# Altium schematic sheet P07_Peripheral.SchDoc
size A4; SheetNumber: 7; SheetTotal: 7
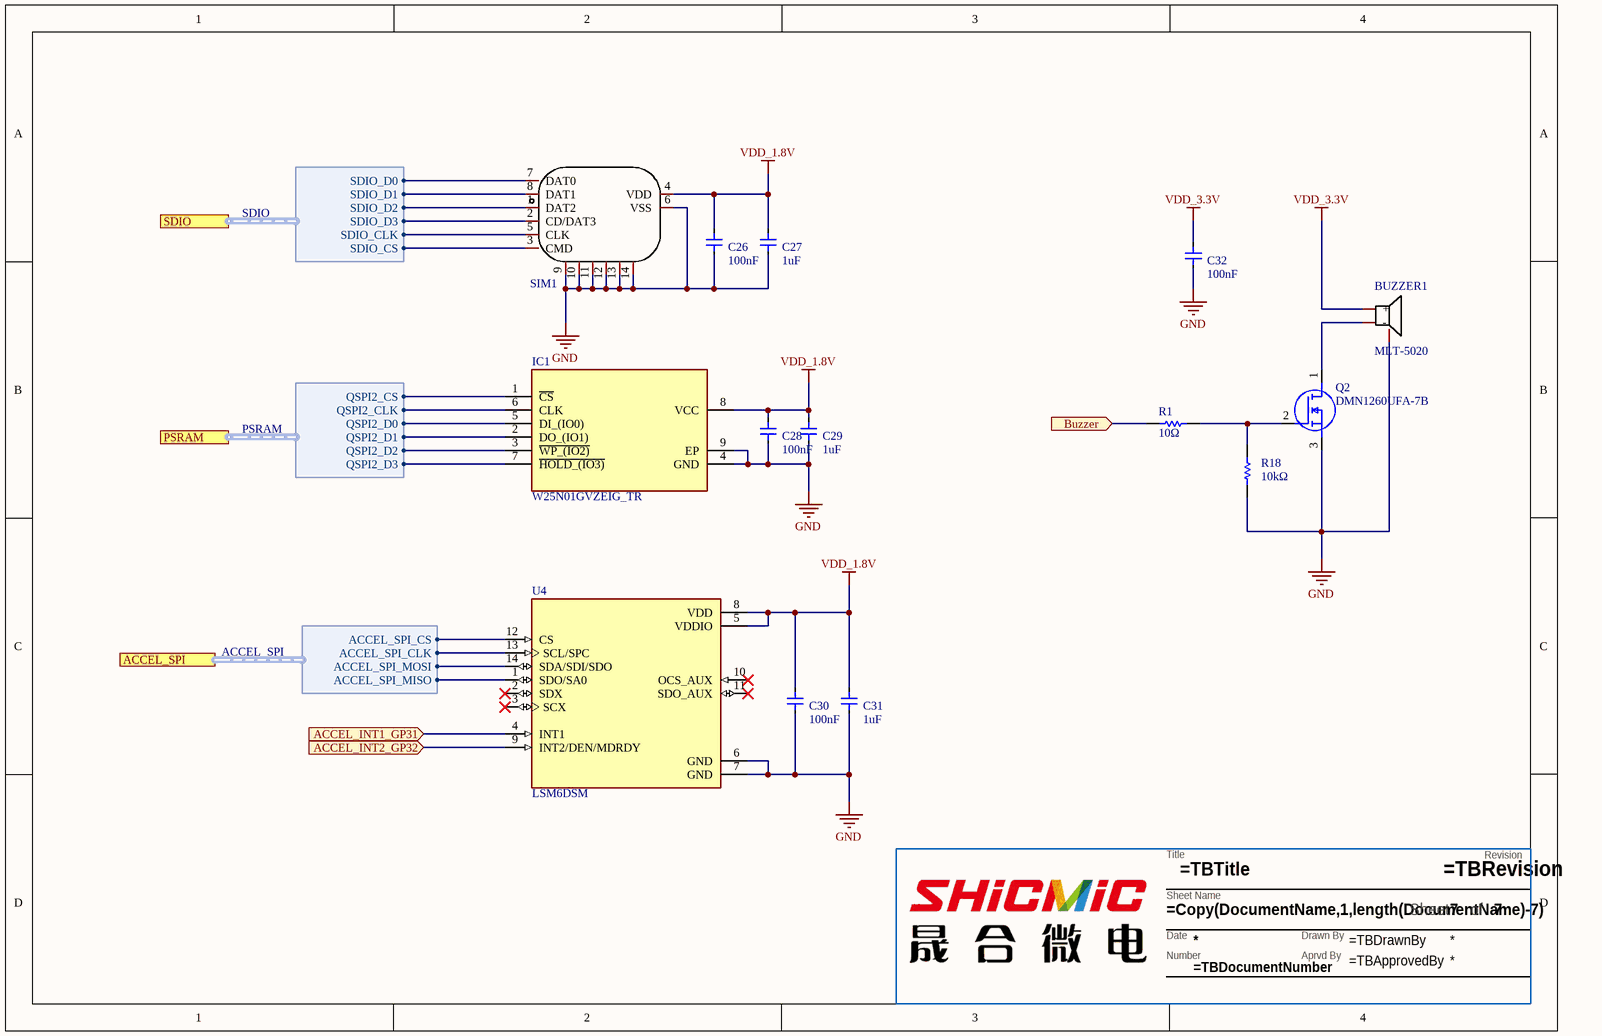
[diagram p0: P07_Peripheral.SchDoc]

## Parts
??  TitleBlock  (value not drawn)  (graphical)
BUZZER1  4000Hz  [BUZ-SMD_L5.0-W5.5-P4.60]  (value not drawn)
C26  100nF  [CAP_0402]
C27  1uF  [CAP_0402]
C28  100nF  [CAP_0402]
C29  1uF  [CAP_0402]
C30  100nF  [CAP_0402]
C31  1uF  [CAP_0402]
C32  100nF  [CAP_0402]
IC1  W25N01GVZEIG_TR  [SON127P800X600X80-9N-D]
Q2  DMN1260UFA-7B  [DMN1260UFA7B]
R1  10Ω  [RES_0402]
R18  10kΩ  [RES_0402]
SIM1  1040310811  [SIM-SMD_8P-1040310811]  (value not drawn)
U4  LSM6DSM  [PQFN50P300X250X86-14N]

## Ports
ACCEL_INT1_GP31 (in), ACCEL_INT2_GP32 (in), ACCEL_SPI (harness ACCEL_SPI), Buzzer (in), PSRAM (harness PSRAM), SDIO (harness SDIO)

## Harnesses
ACCEL_SPI: ACCEL_SPI_CLK, ACCEL_SPI_CS, ACCEL_SPI_MISO, ACCEL_SPI_MOSI
PSRAM: QSPI2_CLK, QSPI2_CS, QSPI2_D0, QSPI2_D1, QSPI2_D2, QSPI2_D3
SDIO: SDIO_CLK, SDIO_CS, SDIO_D0, SDIO_D1, SDIO_D2, SDIO_D3

## Nets
GND: BUZZER1.3(NC) C26.2 C27.2 C28.2 C29.2 C30.2 C31.2 C32.2 IC1.4(GND) IC1.9(EP) Q2.3(S) R18.1 SIM1.6(VSS) SIM1.9 SIM1.10 SIM1.11 SIM1.12 SIM1.13 SIM1.14 U4.6(GND) U4.7(GND)
VDD_1.8V: C26.1 C27.1 C28.1 C29.1 C30.1 C31.1 IC1.8(VCC) SIM1.4(VDD) U4.5(VDDIO) U4.8(VDD)
VDD_3.3V: BUZZER1.1(+) C32.1
ACCEL_INT1_GP31: U4.4(INT1) ; port ACCEL_INT1_GP31
ACCEL_INT2_GP32: U4.9(INT2/DEN/MDRDY) ; port ACCEL_INT2_GP32
Buzzer: R1.2 ; port Buzzer
NetBUZZER1_2: BUZZER1.2(-) Q2.1(D)
NetIC1_1: IC1.1(~{CS}) ; port PSRAM.QSPI2_CS
NetIC1_2: IC1.2(DO_(IO1)) ; port PSRAM.QSPI2_D1
NetIC1_3: IC1.3(~{WP_(IO2)}) ; port PSRAM.QSPI2_D2
NetIC1_5: IC1.5(DI_(IO0)) ; port PSRAM.QSPI2_D0
NetIC1_6: IC1.6(CLK) ; port PSRAM.QSPI2_CLK
NetIC1_7: IC1.7(~{HOLD_(IO3)}) ; port PSRAM.QSPI2_D3
NetQ2_2: Q2.2(G) R1.1 R18.2
NetSIM1_1: SIM1.1(DAT2) ; port SDIO.SDIO_D2
NetSIM1_2: SIM1.2(CD/DAT3) ; port SDIO.SDIO_D3
NetSIM1_3: SIM1.3(CMD) ; port SDIO.SDIO_CS
NetSIM1_5: SIM1.5(CLK) ; port SDIO.SDIO_CLK
NetSIM1_7: SIM1.7(DAT0) ; port SDIO.SDIO_D0
NetSIM1_8: SIM1.8(DAT1) ; port SDIO.SDIO_D1
NetU4_1: U4.1(SDO/SA0) ; port ACCEL_SPI.ACCEL_SPI_MISO
NetU4_12: U4.12(CS) ; port ACCEL_SPI.ACCEL_SPI_CS
NetU4_13: U4.13(SCL/SPC) ; port ACCEL_SPI.ACCEL_SPI_CLK
NetU4_14: U4.14(SDA/SDI/SDO) ; port ACCEL_SPI.ACCEL_SPI_MOSI

Not connected (* = marked no-connect by the designer): U4 2(SDX)* 3(SCX)* 10(OCS_AUX)* 11(SDO_AUX)*

## Notes on the sheet
- (in symbol TitleBlock) Revision; Title; Sheet Name; Sheet; of; Date; Drawn By; Number; Aprvd By

## Library data of the parts
?? = TitleBlock: Title block for Ambiq Schematics. Please have the following parameters entered in Project>Project Options>Parameters: / TBTitle / TBDocumentNumber / TBRevision / TBDrawnBy / TBApprovedBy; AMBIQ PN: TitleBlock
BUZZER1 = MLT-5020: Manufacturer: 华能; Add into BOM: yes; Oscillator Circuit: 无源(外部驱动); Technology Type: 电磁式; Name: 4000Hz; Symbol: MLT-5020; LCSC Part Name: MLT-5020; Supplier Part: C94598; Manufacturer Part: MLT-5020; Supplier Footprint: SMD,5x5mm; JLCPCB Part Class: 扩展库; Datasheet: https://atta.szlcsc.com/upload/public/pdf/source/20210811/111454390007D221D7259018FB170E62.pdf; Supplier: LCSC; Convert to PCB: yes; Value: 4000Hz; Length: 5.2mm; Width: 5.2mm; Height: 2.5mm; Device: MLT-5020
C26 C28 C30 C32 = Capacitor: NONE; Manufacturer: Kyocera AVX; AMBIQ PN: 0201ZD104KAT2A; Tolerance: 10%; Voltage Rating: 10V; Supplier 1: Arrow Electronics; Supplier Part Number 1: 0201ZD104KAT2A; Manufacturer Part Number: 0201ZD104KAT2A; RoHS: Yes; Category: Ceramic Capacitors; Stock 1: 105000; Pricing 1: 15000=0.00770, 30000=0.00750, 45000=0.00740, 60000=0.00720, 75000=0.00690, 150000=0.00620 (USD); Mount: Surface Mount; Case/Package: 0201; Case Code (Metric): 0603; Case Code (Imperial): 0201; Min Operating Temperature: -55°C; Max Operating Temperature: 85°C; Capacitance: 100nF; Packaging: Tape and Reel; Voltage Rating (DC): 10V; Series: -; Lead Free: Lead Free; RoHS Compliant: Yes; ComponentLink1URL: http://www.mouser.com/ds/2/40/cx5r-776519.pdf?src-supplier=Mouser; ComponentLink1Description: http://www.mouser.com/ds/2/40/cx5r-776519.pdf?src-supplier=Mouser
C27 C29 C31 = Capacitor: NONE; Manufacturer: Samsung; Manufacturer Part Number: CL05A105MP5NNNC; AMBIQ PN: CL05A105KP5NNNC; Tolerance: 20%; Voltage Rating: 10V; Dielectric: X5R; Supplier 1: Newark; Supplier Part Number 1: 82AC9184; RoHS: Yes; Category: Ceramic Capacitors; Mount: Surface Mount; Case/Package: 0402; Case Code (Metric): 1005; Case Code (Imperial): 0402; Min Operating Temperature: -55°C; Max Operating Temperature: 85°C; Capacitance: 1uF; Packaging: Tape and Reel; Voltage Rating (DC): 10V; Series: CL; Construction: Flat; Length: 1mm; Width: 0.02inch; Height: 0.5mm; Thickness: 0.022inch; Depth: 0.5mm; Radiation Hardening: No; Lead Free: Lead Free; RoHS Compliant: Yes; ComponentLink1URL: https://datasheet.ciiva.com/25802/cl05a105mp5nnnc-25802049.pdf?src-supplier=Digi-Key; ComponentLink1Description: https://datasheet.ciiva.com/25802/cl05a105mp5nnnc-25802049.pdf?src-supplier=Digi-Key; Package Quantity: 1
IC1 = W25N01GVZEIG_TR: Integrated Circuit; Manufacturer_Name: Winbond; Manufacturer_Part_Number: W25N01GVZEIG TR; Datasheet Link: https://www.winbond.com/resource-files/w25n01gv revg 032116.pdf; Height: 0.8mm; Mouser Part Number: 454-W25N01GVZEIGTR; Mouser Price/Stock: https://www.mouser.co.uk/ProductDetail/Winbond/W25N01GVZEIG-TR?qs=qSfuJ%252Bfl%2Fd6niBi0Qz1MPg%3D%3D; Arrow Part Number: W25N01GVZEIG TR; Arrow Price/Stock: https://www.arrow.com/en/products/w25n01gvzeigtr/winbond-electronics?region=nac
Q2 = DMN1260UFA-7B: MOSFET (N-Channel); Manufacturer_Name: Diodes Incorporated; Datasheet Link: https://www.diodes.com/assets/Datasheets/DMN1260UFA.pdf; Height: 0.4mm; Manufacturer_Part_Number: DMN1260UFA-7B; Mouser Part Number: 621-DMN1260UFA-7B; Mouser Price/Stock: https://www.mouser.co.uk/ProductDetail/Diodes-Incorporated/DMN1260UFA-7B?qs=TL2rE588Q1GjQdkyrZCA4w%3D%3D; Arrow Part Number: DMN1260UFA-7B; Arrow Price/Stock: https://www.arrow.com/en/products/dmn1260ufa-7b/diodes-incorporated
R1 R18 = Resistor: Surface Mount Thick Film Resistor, Rc Series, 10 Kohm, 62.5 Mw, - 1%, 50 V, 0402 [1005 Metric]; Manufacturer: Yageo; AMBIQ PN: RC0402FR-0710KL; Resistance: 10kR; Power Rating: 62.5mW; Voltage Rating: 50V; Max Power Dissipation: 63mW; Temperature Coefficient: 100ppm/°C; Supplier 1: Arrow Electronics; Supplier Part Number 1: RC0402FR-0710KL; Manufacturer Part Number: RC0402FR-0710KL; RoHS: Yes; Category: Chip SMD Resistors; Stock 1: 7776428; Pricing 1: 10000=0.00210 (USD); Case/Package: 0402; Case Code (Metric): 1005; Case Code (Imperial): 0402; Min Operating Temperature: -55°C; Max Operating Temperature: 155°C; Packaging: Tape and Reel; Resistor Type: Thick Film; Number of Terminations: 2; Termination: SMD/SMT; Voltage Rating (DC): 50V; Features: Moisture Resistant; Series: RC; Construction: Rectangular; Length: 1mm; Width: 0.5mm; Height: 0.32mm; Depth: 0.5mm; REACH SVHC: No SVHC; Military Standard: Not; Lead Free: Lead Free; RoHS Compliant: Yes; ComponentLink1URL: https://datasheet.ciiva.com/7660/38568-7660787.pdf?src-supplier=Element14; ComponentLink1Description: https://datasheet.ciiva.com/7660/38568-7660787.pdf?src-supplier=Element14; ComponentLink2URL: https://datasheet.ciiva.com/7849/1686128-7849814.pdf?src-supplier=Element14; ComponentLink2Description: https://datasheet.ciiva.com/7849/1686128-7849814.pdf?src-supplier=Element14; ComponentLink3URL: https://datasheet.ciiva.com/7983/1018594-7983486.pdf?src-supplier=Element14; Tolerance: 1%; Number of Pins: 2; Resistance Tolerance: 1%; Working Voltage: 50V; Lead Pitch: 0.2mm
SIM1 = 1040310811: Manufacturer: MOLEX; Add into BOM: yes; Card Connection Mode: 拔插式; Card Type: MicroSD卡(TF卡); Connector Type: 卡座; Maximum Body Height: 1.42mm; Name: 1040310811; Symbol: 1040310811; Device: 1040310811; LCSC Part Name: 拔插式 MicroSD卡(TF卡) 卡座; Supplier Part: C585350; Manufacturer Part: 1040310811; Supplier Footprint: SMD; JLCPCB Part Class: 扩展库; Datasheet: https://atta.szlcsc.com/upload/public/pdf/source/20201117/C585350_D1F0B30BD23514449186B2E50ACE8BBF.pdf; Supplier: LCSC; Convert to PCB: yes; Operating Temperature Range: -
U4 = LSM6DSM: Accelerometer, Gyroscope, Temperature, 6 Axis Sensor IÂ²C, SPI Output; MF: STMicroelectronics; Availability: In Stock; Purchase-URL: https://pricing.snapeda.com/search/part/LSM6DSM/?ref=eda; Package: VFLGA-14 STMicroelectronics; MP: LSM6DSM; Value: *; Check_prices: https://www.snapeda.com/parts/LSM6DSM/STMicroelectronics/view-part/?ref=eda; SnapEDA_Link: https://www.snapeda.com/parts/LSM6DSM/STMicroelectronics/view-part/?ref=snap; Price: None